# EAGLE schematic max232 (EAGLE 6.4)
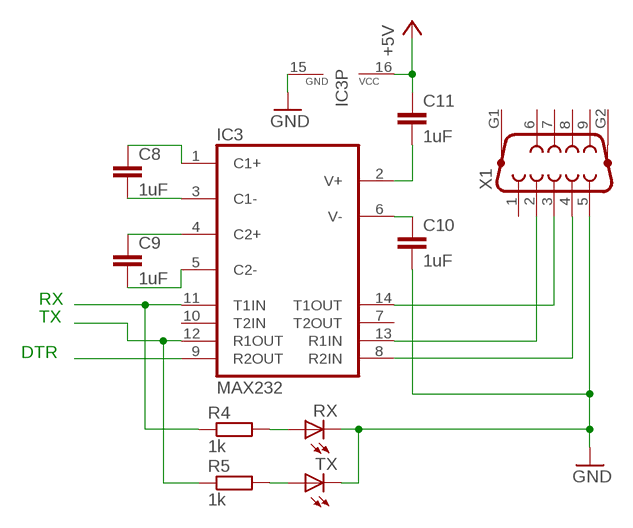
[diagram p0: schematic, sheet 1]

## Parts
C8  1uF  C5/3.5  [C5B3.5]
C9  1uF  C5/3.5  [C5B3.5]
C10  1uF  C5/3.5  [C5B3.5]
C11  1uF  C5/3.5  [C5B3.5]
IC3  MAX232  [DIL16]
R4  1k  R-EU_0309/10  [0309/10]
R5  1k  R-EU_0309/10  [0309/10]
RX  LED3MM  [LED3MM]
TX  LED3MM  [LED3MM]
X1  F09HP  [F09HP]

## Nets
+5V: C11.1 IC3.16(VCC)
GND: C10.2 IC3.15(GND) RX.K(C) TX.K(C) X1.5
N$3: IC3.9(R2OUT)
N$8: C9.2 IC3.5(C2-)
N$9: IC3.8(R2IN) X1.4
N$10: IC3.14(T1OUT) X1.3
N$11: IC3.13(R1IN) X1.2
N$23: R4.2 RX.A
N$24: R5.2 TX.A
N$39: C8.1 IC3.1(C1+)
N$40: C8.2 IC3.3(C1-)
N$41: C9.1 IC3.4(C2+)
N$43: C10.1 IC3.6(V-)
N$44: C11.2 IC3.2(V+)
RX: IC3.11(T1IN) R4.1
TX: IC3.12(R1OUT) R5.1
Unconnected: IC3.7(T2OUT) IC3.10(T2IN) X1.1 X1.6 X1.7 X1.8 X1.9 X1.G1 X1.G2

## Notes on the sheet
- RX
- TX
- DTR

## Library data of the parts
C8-C11 = capacitor-wima:C: CAPACITOR naming: grid - package width
IC3 = maxim:MAX232: RS232 TRANSEIVER; MF: MAXIM; MPN: MAX232ACPE+; OC_FARNELL: 9723773; OC_NEWARK: 68K4544
R4 R5 = rcl:R-EU_: RESISTOR, European symbol
RX TX = led:LED: LED OSRAM: - CHIPLED LG R971, LG N971, LY N971, LG Q971, LY Q971, LO R971, LY R971 LH N974, LH R974 LS Q976, LO Q976, LY Q976 LO Q996 - Hyper CHIPLED LW Q18S LB Q993, LB Q99A, LB R99A - SideLED LS A670, LO A670, LY A670, LG A670, LP A670 LB A673, LV A673, LT A673, LW A673 LH A674 LY A675 LS A676, LA A676, LO A676, LY A676, LW A676 LS A679, LY A679, LG A679 - Hyper Micro SIDELED® LS Y876, LA Y876, LO Y876, LY Y876 LT Y87S - SmartLED LW L88C, LW L88S LB L89C, LB L89S, LG L890 LS L89K, LO L89K, LY L89K LS L896, LA L896, LO L896, LY L896 - TOPLED LS T670, LO T670, LY T670, LG T670, LP T670 LSG T670, LSP T670, LSY T670, LOP T670, LYG T670 LG T671, LOG T671, LSG T671 LB T673, LV T673, LT T673, LW T673 LH T674 LS T676, LA T676, LO T676, LY T676, LB T676, LH T676, LSB T676, LW T676 LB T67C, LV T67C, LT T67C, LS T67K, LO T67K, LY T67K, LW E67C LS E67B, LA E67B, LO E67B, LY E67B, LB E67C, LV E67C, LT E67C LW T67C LS T679, LY T679, LG T679 LS T770, LO T770, LY T770, LG T770, LP T770 LB T773, LV T773, LT T773, LW T773 LH T774 LS E675, LA E675, LY E675, LS T675 LS T776, LA T776, LO T776, LY T776, LB T776 LHGB T686 LT T68C, LB T68C - Hyper Mini TOPLED® LB M676 - Mini TOPLED Santana® LG M470 LS M47K, LO M47K, LY M47K Source: http://www.osram.convergy.de LUXEON: - LUMILED® LXK2-PW12-R00, LXK2-PW12-S00, LXK2-PW14-U00, LXK2-PW14-V00 LXK2-PM12-R00, LXK2-PM12-S00, LXK2-PM14-U00 LXK2-PE12-Q00, LXK2-PE12-R00, LXK2-PE12-S00, LXK2-PE14-T00, LXK2-PE14-U00 LXK2-PB12-K00, LXK2-PB12-L00, LXK2-PB12-M00, LXK2-PB14-N00, LXK2-PB14-P00, LXK2-PB14-Q00 LXK2-PR12-L00, LXK2-PR12-M00, LXK2-PR14-Q00, LXK2-PR14-R00 LXK2-PD12-Q00, LXK2-PD12-R00, LXK2-PD12-S00 LXK2-PH12-R00, LXK2-PH12-S00 LXK2-PL12-P00, LXK2-PL12-Q00, LXK2-PL12-R00 Source: www.luxeon.com KINGBRIGHT: KA-3528ASYC Source: www.kingbright.com
X1 = con-subd:F09HP: SUB-D; OC_FARNELL: unknown; OC_NEWARK: unknown